# Altium project project.PrjPcb
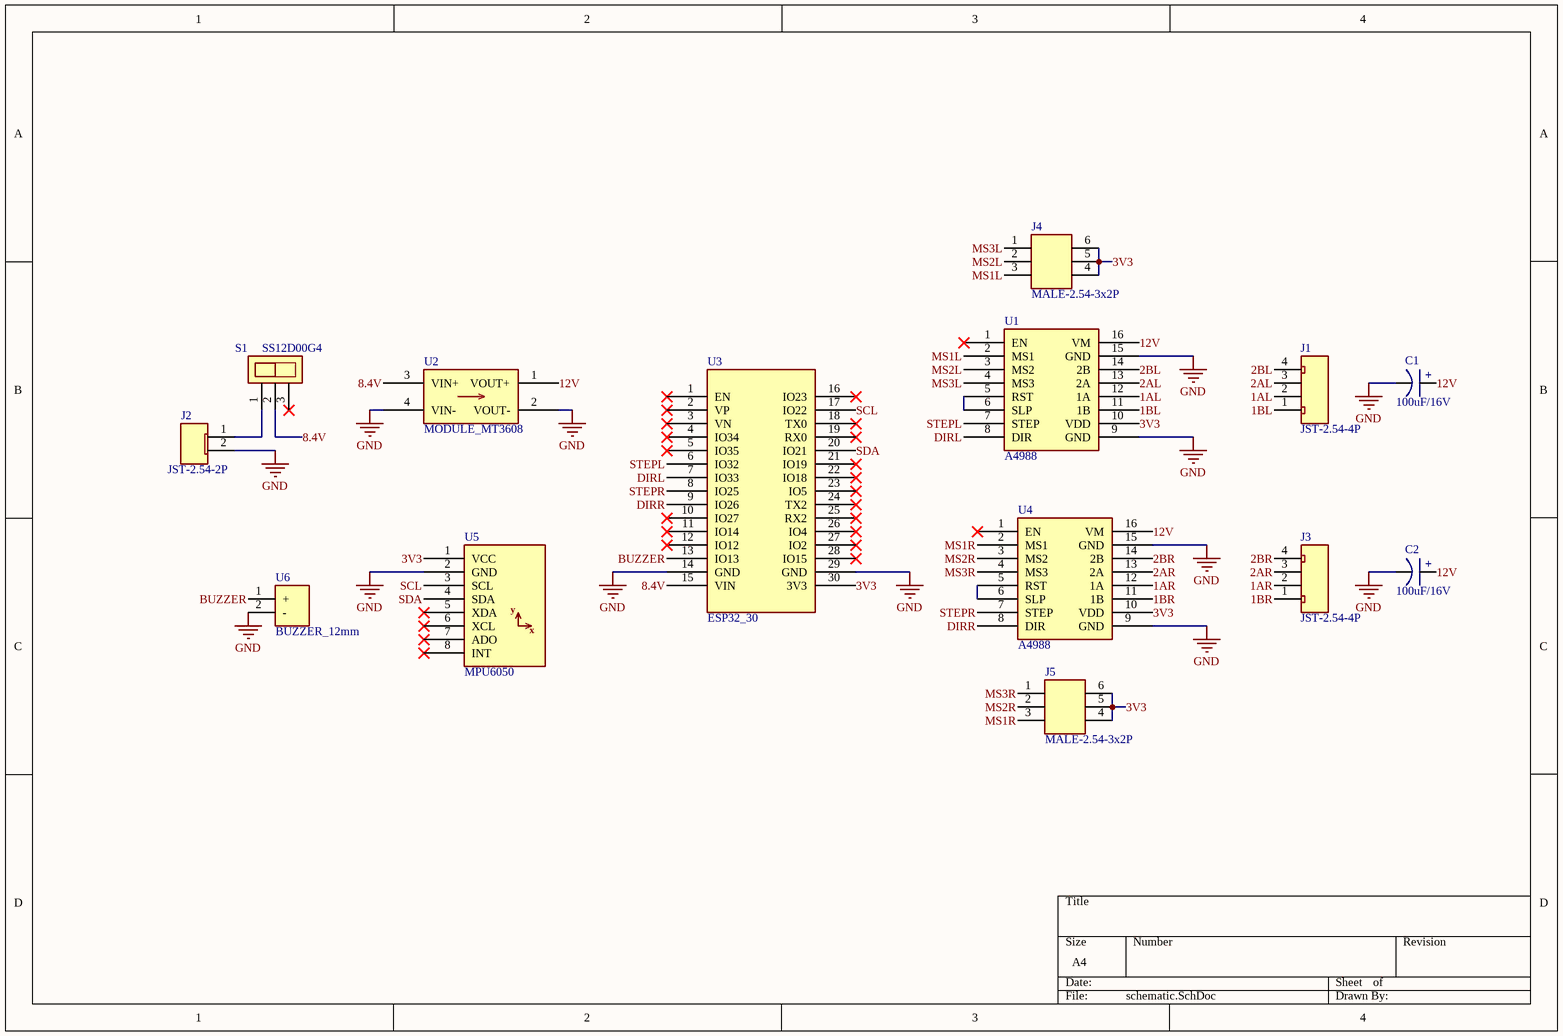
[diagram p0: schematic.SchDoc]
1 sheet, 14 parts. Net scope: global (net labels, ports and power ports of the same name join across sheets).
Board file: pcb.PcbDoc

## Sheet schematic.SchDoc
size A4; SheetNumber: 1; SheetTotal: 1

### Parts
C1  100uF/16V  [100uF/16V]
C2  100uF/16V  [100uF/16V]
J1  JST-2.54-4P  [JST-2.54-4P]
J2  JST-2.54-2P  [JST-2.54-2P]
J3  JST-2.54-4P  [JST-2.54-4P]
J4  MALE-2.54-3x2P  [MALE-2.54-3x2P]
J5  MALE-2.54-3x2P  [MALE-2.54-3x2P]
S1  SS12D00G4  [SS12D00G4]
U1  A4988  [A4988]
U2  MODULE_MT3608  [MODULE_MT3608]
U3  ESP32_30  [ESP32_30]
U4  A4988  [A4988]
U5  MPU6050  [MPU6050]
U6  BUZZER_12mm  [BUZZER_12mm]

### Nets
GND: C1.1 C2.1 J2.2 U1.9(GND) U1.15(GND) U2.2(VOUT-) U2.4(VIN-) U3.14(GND) U3.29(GND) U4.9(GND) U4.15(GND) U5.2(GND) U6.2(-)
1AL: J1.2 U1.12(1A)
1AR: J3.2 U4.12(1A)
1BL: J1.1 U1.11(1B)
1BR: J3.1 U4.11(1B)
2AL: J1.3 U1.13(2A)
2AR: J3.3 U4.13(2A)
2BL: J1.4 U1.14(2B)
2BR: J3.4 U4.14(2B)
3V3: J4.4 J4.5 J4.6 J5.4 J5.5 J5.6 U1.10(VDD) U3.30(3V3) U4.10(VDD) U5.1(VCC)
8.4V: S1.2 U2.3(VIN+) U3.15(VIN)
12V: C1.2 C2.2 U1.16(VM) U2.1(VOUT+) U4.16(VM)
BUZZER: U3.13(IO13) U6.1(+)
DIRL: U1.8(DIR) U3.7(IO33)
DIRR: U3.9(IO26) U4.8(DIR)
MS1L: J4.3 U1.2(MS1)
MS1R: J5.3 U4.2(MS1)
MS2L: J4.2 U1.3(MS2)
MS2R: J5.2 U4.3(MS2)
MS3L: J4.1 U1.4(MS3)
MS3R: J5.1 U4.4(MS3)
SCL: U3.17(IO22) U5.3(SCL)
SDA: U3.20(IO21) U5.4(SDA)
STEPL: U1.7(STEP) U3.6(IO32)
STEPR: U3.8(IO25) U4.7(STEP)
NetJ2_1: J2.1 S1.1
NetU1_5: U1.5(RST) U1.6(SLP)
NetU4_5: U4.5(RST) U4.6(SLP)

Not connected (* = marked no-connect by the designer): S1 3*; U1 1(EN)*; U3 1(EN)* 2(VP)* 3(VN)* 4(IO34)* 5(IO35)* 10(IO27)* 11(IO14)* 12(IO12)* 16(IO23)* 18(TX0)* 19(RX0)* 21(IO19)* 22(IO18)* 23(IO5)* 24(TX2)* 25(RX2)* 26(IO4)* 27(IO2)* 28(IO15)*; U4 1(EN)*; U5 5(XDA)* 6(XCL)* 7(ADO)* 8(INT)*

### Notes on the sheet
- (in symbol 100uF/16V) +
- (in symbol MPU6050) y; x

### Library data of the parts
C1 C2 = 100uF/16V: Electrolytic Capacitor 100uF/16V
J1 J3 = JST-2.54-4P: Female Connector JST 4 Vias, 2.54mm.
J2 = JST-2.54-2P: Female Connector JST 2 Vias, 2.54mm.
J4 J5 = MALE-2.54-3x2P: Male Header Connector 2.54mm 3x2 Pins.; JLCPCB PN: C65114
U1 U4 = A4988: Module Stepper Motor Driver 8-35V 2A 20x15mm; ComponentLink1Description: Datasheet; ComponentLink1URL: https://www.pololu.com/file/0J450/a4988_DMOS_microstepping_driver_with_translator.pdf
U2 = MODULE_MT3608: MODULE BUCK STEP UP 2A 37x17mm; ComponentLink1Description: Datasheet; ComponentLink1URL: https://www.olimex.com/Products/Breadboarding/BB-PWR-3608/resources/MT3608.pdf
U3 = ESP32_30: Microcontoller Board 30 Pins Wifi 2.4GHz BLE 4.2 ESP32-WROOM-32D; ComponentLink1Description: Datasheet; ComponentLink1URL: https://www.mouser.com/datasheet/2/891/esp32_wroom_32d_esp32_wroom_32u_datasheet_en-1365844.pdf
U5 = MPU6050: IMU ACCEL/GYRO 3-AXIS I2C; ComponentLink1Description: Datasheet; ComponentLink1URL: https://invensense.tdk.com/wp-content/uploads/2015/02/MPU-6000-Datasheet1.pdf
U6 = BUZZER_12mm: BUZZER MAGNETIC 12MM; Digikey PN: 433-WT-1209T-ND; Mouser PN: 433-WT-1209T-ND